# EAGLE design double_in1_atmega (EAGLE 9.1.0)
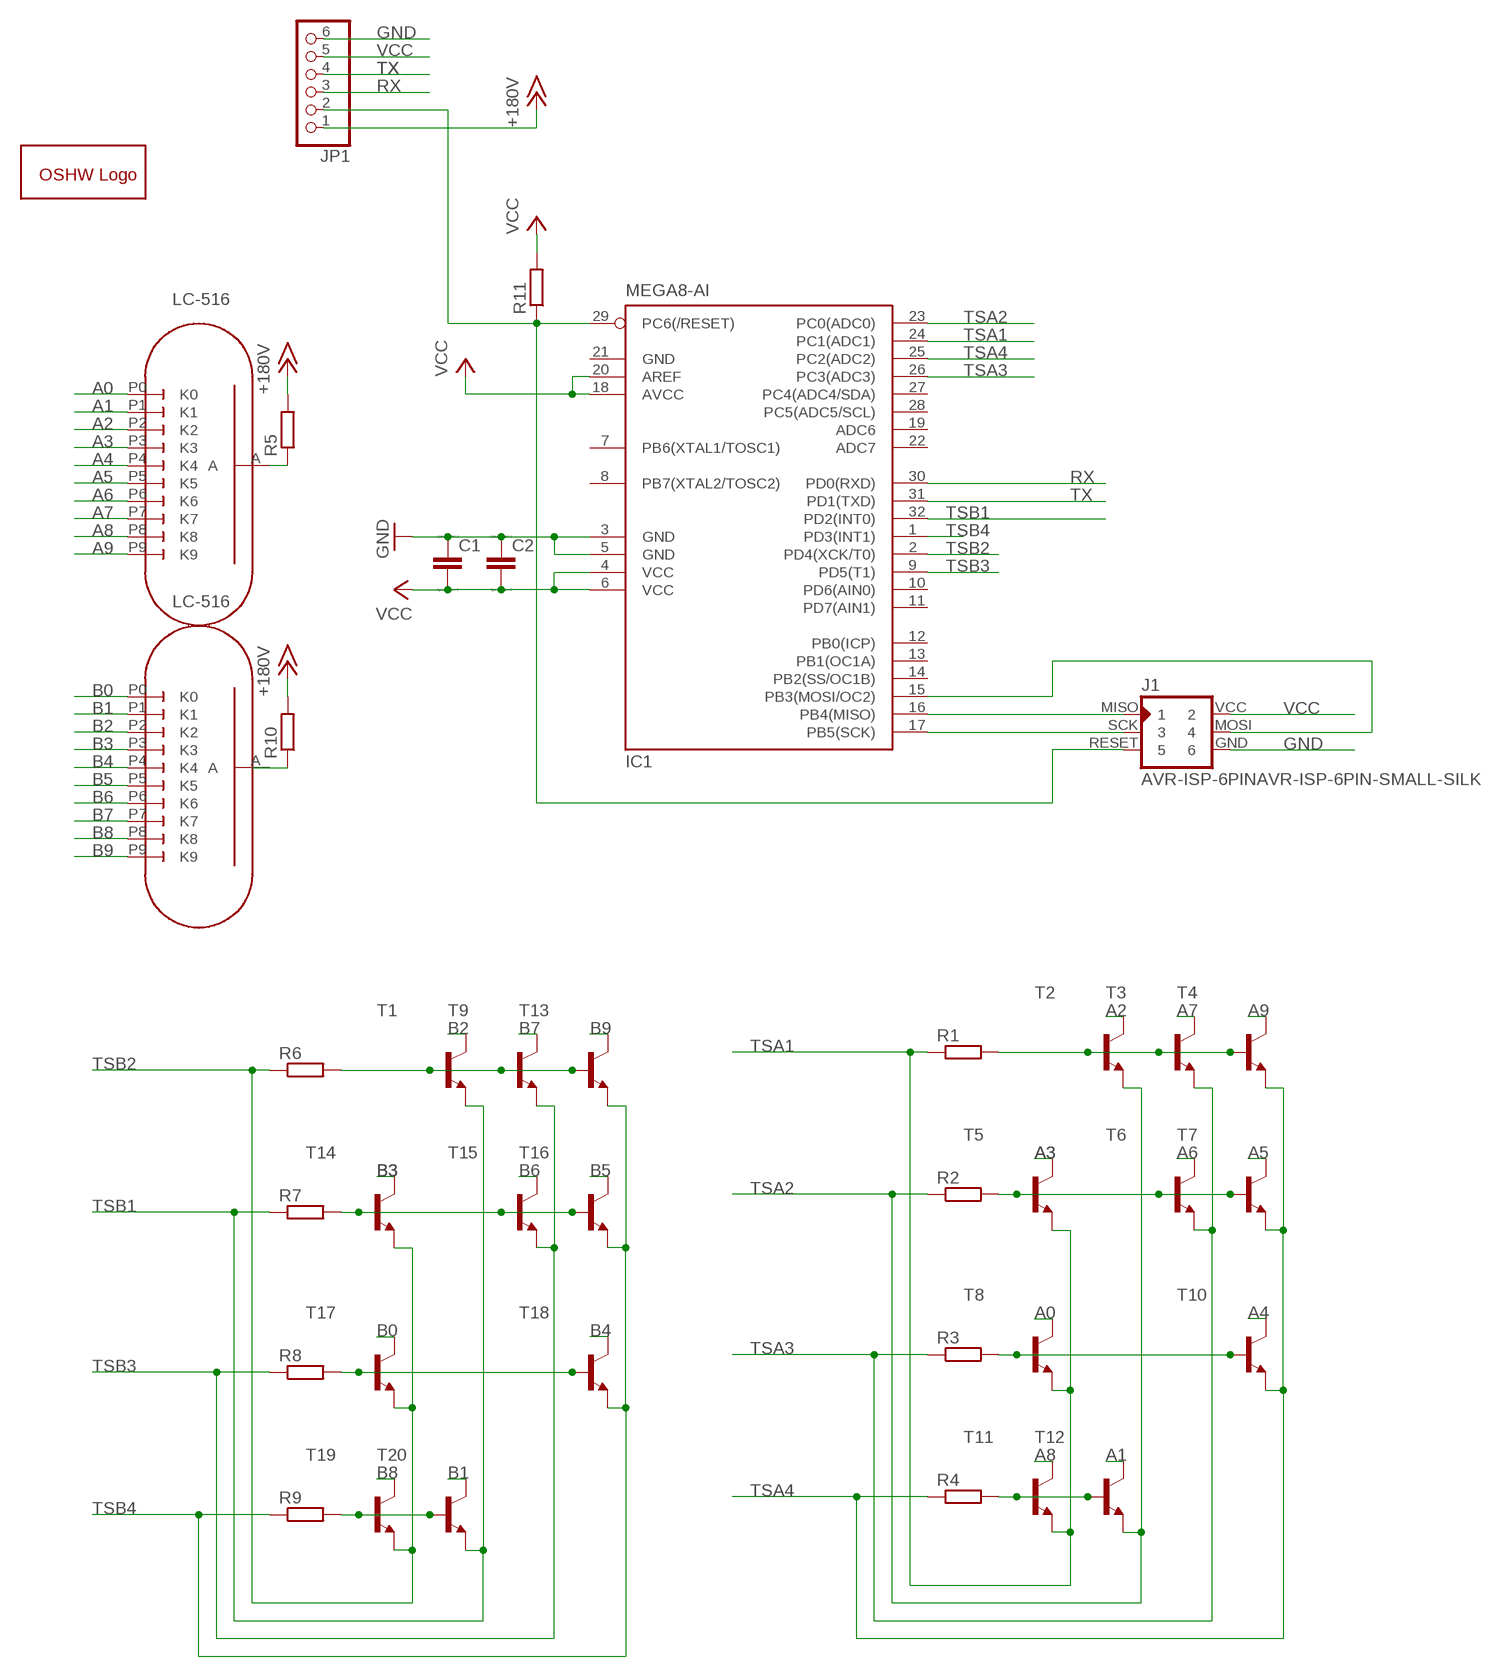
[diagram p0: schematic, sheet 1]

## Parts
C1  C  [C0805]
C2  C  [C0805]
GOLD_ORB_SM1  OSHWLOGOLOGO5MM  [OSHW_5MM]
IC1  MEGA8-AI  [TQFP32-08]
J1  AVR-ISP-6PINAVR-ISP-6PIN-SMALL-SILK  [AVR-ISP-6PIN-SMAILL-SILK]
JP1  PINHD-1X6  [1X06]
R1  R-EU_R0603  [R0603]
R2  R-EU_R0603  [R0603]
R3  R-EU_R0603  [R0603]
R4  R-EU_R0603  [R0603]
R5  R-EU_M1206  [M1206]
R6  R-EU_R0603  [R0603]
R7  R-EU_R0603  [R0603]
R8  R-EU_R0603  [R0603]
R9  R-EU_R0603  [R0603]
R10  R-EU_M1206  [M1206]
R11  R-EU_R0603  [R0603]
T1  MMBTA42LT1-NPN-SOT23-BEC  [SOT23-BEC]
T2  MMBTA42LT1-NPN-SOT23-BEC  [SOT23-BEC]
T3  MMBTA42LT1-NPN-SOT23-BEC  [SOT23-BEC]
T4  MMBTA42LT1-NPN-SOT23-BEC  [SOT23-BEC]
T5  MMBTA42LT1-NPN-SOT23-BEC  [SOT23-BEC]
T6  MMBTA42LT1-NPN-SOT23-BEC  [SOT23-BEC]
T7  MMBTA42LT1-NPN-SOT23-BEC  [SOT23-BEC]
T8  MMBTA42LT1-NPN-SOT23-BEC  [SOT23-BEC]
T9  MMBTA42LT1-NPN-SOT23-BEC  [SOT23-BEC]
T10  MMBTA42LT1-NPN-SOT23-BEC  [SOT23-BEC]
T11  MMBTA42LT1-NPN-SOT23-BEC  [SOT23-BEC]
T12  MMBTA42LT1-NPN-SOT23-BEC  [SOT23-BEC]
T13  MMBTA42LT1-NPN-SOT23-BEC  [SOT23-BEC]
T14  MMBTA42LT1-NPN-SOT23-BEC  [SOT23-BEC]
T15  MMBTA42LT1-NPN-SOT23-BEC  [SOT23-BEC]
T16  MMBTA42LT1-NPN-SOT23-BEC  [SOT23-BEC]
T17  MMBTA42LT1-NPN-SOT23-BEC  [SOT23-BEC]
T18  MMBTA42LT1-NPN-SOT23-BEC  [SOT23-BEC]
T19  MMBTA42LT1-NPN-SOT23-BEC  [SOT23-BEC]
T20  MMBTA42LT1-NPN-SOT23-BEC  [SOT23-BEC]
U$1  LC-516  [LC-516]
U$2  LC-516  [LC-516]

## Nets
+15V: JP1.1 R5.2 R10.2 ; supply symbol labelled +180V
A0: T8.C U$1.P0(K0)
A1: T12.C U$1.P1(K1)
A2: T2.C U$1.P2(K2)
A3: T5.C U$1.P3(K3)
A4: T10.C U$1.P4(K4)
A5: T7.C U$1.P5(K5)
A6: T6.C U$1.P6(K6)
A7: T3.C U$1.P7(K7)
A8: T11.C U$1.P8(K8)
A9: T4.C U$1.P9(K9)
B0: T17.C U$2.P0(K0)
B1: T20.C U$2.P1(K1)
B2: T1.C U$2.P2(K2)
B3: T14.C U$2.P3(K3)
B4: T18.C U$2.P4(K4)
B5: T16.C U$2.P5(K5)
B6: T15.C U$2.P6(K6)
B7: T9.C U$2.P7(K7)
B8: T19.C U$2.P8(K8)
B9: T13.C U$2.P9(K9)
GND: C1.1 C2.1 IC1.3(GND) IC1.5(GND) J1.GND JP1.6
N$1: R10.1 U$2.A
N$2: IC1.29(PC6(/RESET)) J1.RESET JP1.2 R11.1
N$4: R5.1 U$1.A
N$5: IC1.16(PB4(MISO)) J1.MISO
N$9: IC1.17(PB5(SCK)) J1.SCK
N$10: IC1.15(PB3(MOSI/OC2)) J1.MOSI
N$11: R6.2 T1.B T9.B T13.B
N$12: R9.2 T19.B T20.B
N$13: R7.2 T14.B T15.B T16.B
N$14: R4.2 T11.B T12.B
N$15: R8.2 T17.B T18.B
N$16: R3.2 T8.B T10.B
N$17: R2.2 T5.B T6.B T7.B
N$18: R1.2 T2.B T3.B T4.B
RX: IC1.30(PD0(RXD)) JP1.3
TSA1: IC1.24(PC1(ADC1)) R1.1 T5.E T8.E T11.E
TSA2: IC1.23(PC0(ADC0)) R2.1 T2.E T12.E
TSA3: IC1.26(PC3(ADC3)) R3.1 T3.E T6.E
TSA4: IC1.25(PC2(ADC2)) R4.1 T4.E T7.E T10.E
TSB1: IC1.32(PD2(INT0)) R7.1 T1.E T20.E
TSB2: IC1.2(PD4(XCK/T0)) R6.1 T14.E T17.E T19.E
TSB3: IC1.9(PD5(T1)) R8.1 T9.E T15.E
TSB4: IC1.1(PD3(INT1)) R9.1 T13.E T16.E T18.E
TX: IC1.31(PD1(TXD)) JP1.4
VCC: C1.2 C2.2 IC1.4(VCC) IC1.6(VCC) IC1.18(AVCC) IC1.20(AREF) J1.VCC JP1.5 R11.2
Unconnected: IC1.7(PB6(XTAL1/TOSC1)) IC1.8(PB7(XTAL2/TOSC2)) IC1.10(PD6(AIN0)) IC1.11(PD7(AIN1)) IC1.12(PB0(ICP)) IC1.13(PB1(OC1A)) IC1.14(PB2(SS/OC1B)) IC1.19(ADC6) IC1.22(ADC7) IC1.27(PC4(ADC4/SDA)) IC1.28(PC5(ADC5/SCL))

## Power pins joined to a net without a drawn wire
GND: IC1.21(GND)

## Library data of the parts
C1 C2 = eagle-ltspice:C: CAPACITOR, European symbol; SPICEMODEL: NONE; SPICEPREFIX: C
GOLD_ORB_SM1 = oshw:OSHWLOGO: The OSHW logo for PCB layout
IC1 = atmel:MEGA8: MICROCONTROLLER 8 Kbytes FLASH, 1 kbytes SRAM, 512 bytes EEPROM, USART, 6-channel 10 bit ADC, 2-channel 8 bit ADC Pin compatible with Atmega48, ATMega88, ATMega168 Source: avr.lbr; MPN: ATMEGA8-16AU; OC_FARNELL: 9171371; OC_NEWARK: 73M8863
J1 = avr-isp:AVR-ISP-6PIN: AVR ISP 6pin 3x2 pin header
JP1 = pinhead:PINHD-1X6: PIN HEADER
R1-R4 R6-R9 R11 = resistor:R-EU_: RESISTOR, European symbol
R5 R10 = rcl:R-EU_: RESISTOR, European symbol; SPICEPREFIX: R
T1-T20 = transistor:*-NPN-: NPN Transistror BF959 corrected 2008.03.06
U$1 U$2 = LC-516_play:LC-516: Nixie Tube LC-516 with play to align nixie

## Net classes
0 default: clearance 0.205 mm

## Board
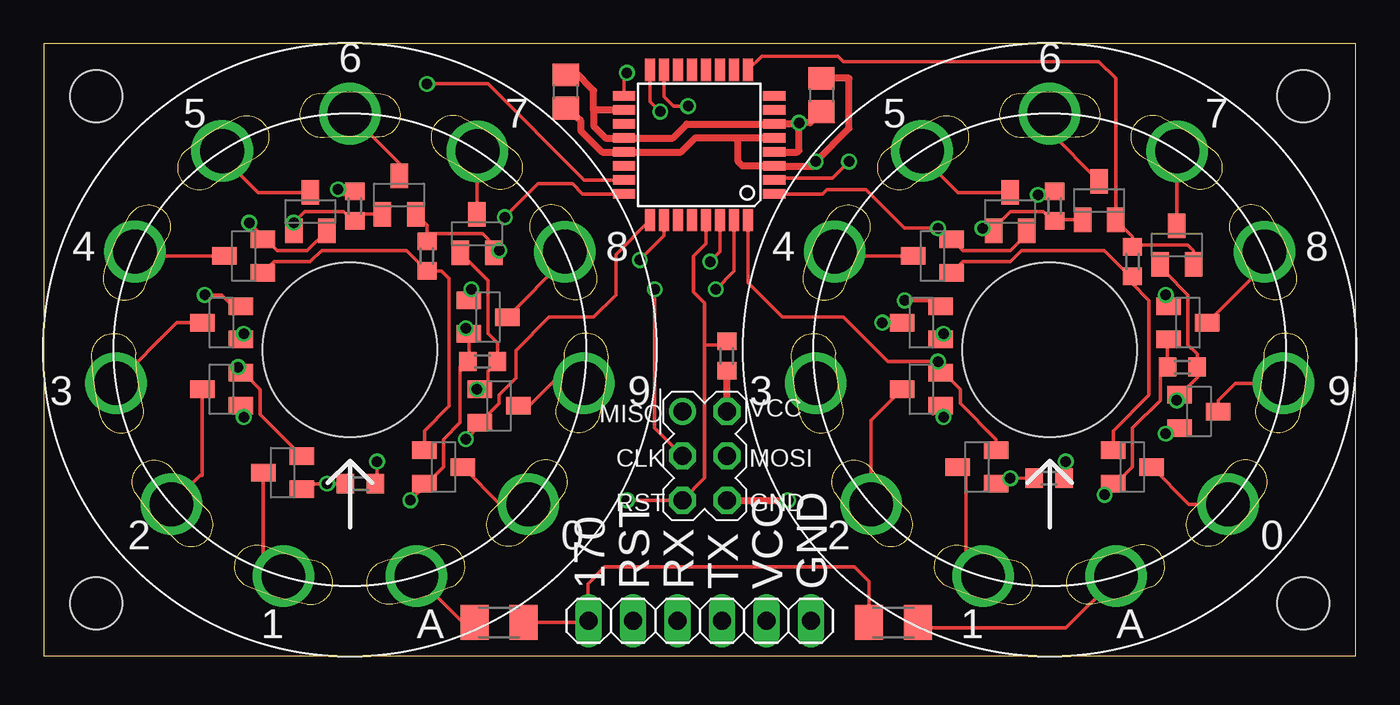
[diagram p1: board, top side]
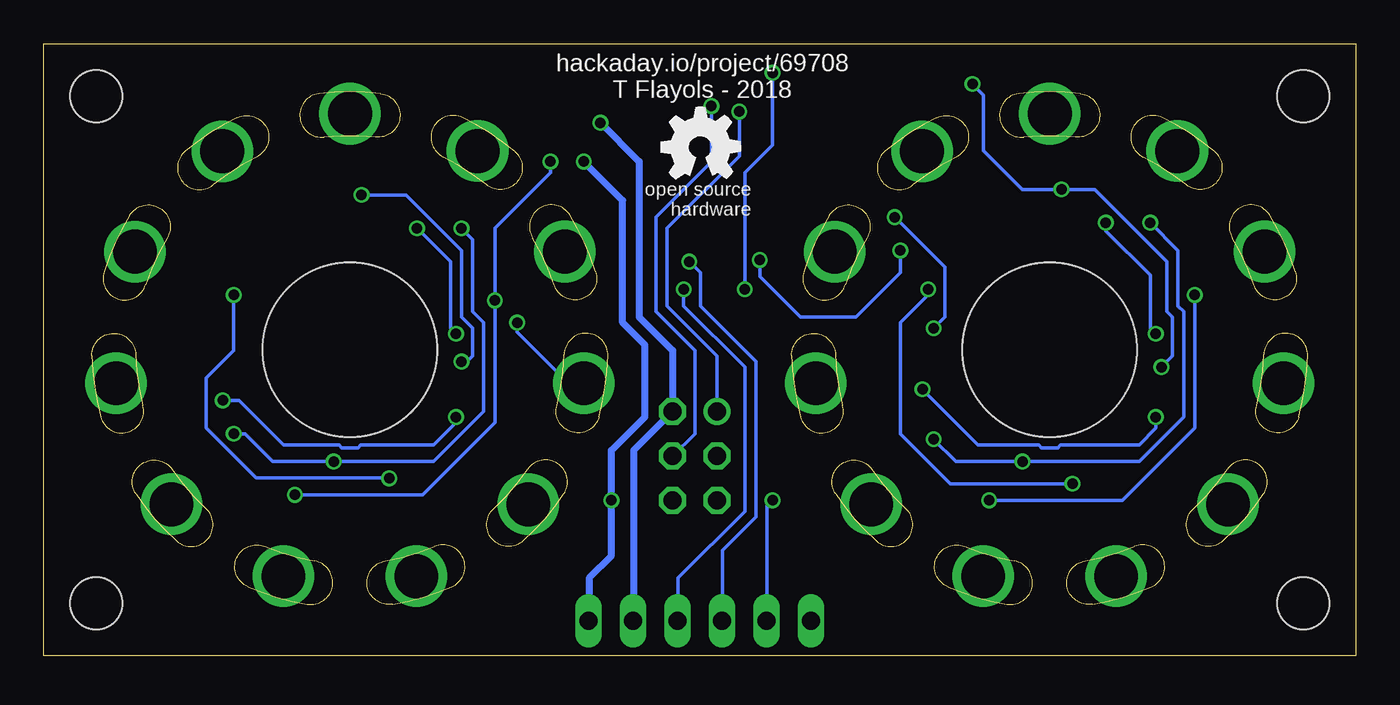
[diagram p2: board, bottom side, seen from below]

Size 75 x 35 mm. Coordinates in mm from the lower left corner, seen from the top.
Outline: 0,0 75,0 75,35 0,35 0,0
Copper layers (1*16): Top 0.035mm / dielectric 1.5mm / Bottom 0.035mm
Design rules "SeeedStudio_2layer_DRU_no_angle_20140221": minimum track width 6mil, minimum drill 12mil, track to track 6mil, track to pad 6mil, pad to pad 6mil, via to via 6mil, smd to smd 0mil, copper to edge 10mil, drill to drill 10mil, minimum pad ring 10mil, minimum via ring 6mil, stop-mask expansion 2mil, vias tented up to drill 100mil, thermal gap 10mil
Holes 3 mm at 3,32 3,3 72,3 72,32

### Footprints (pad centres in the part's own frame; a part is rotated, then mirrored left to right if it is on the bottom)
C0805 = smd 1.3 x 1.5: 1 -0.95,0; 2 0.95,0
TQFP32-08 = smd 1.27 x 0.559: 1 -4.293,2.8; 2 -4.293,2; 3 -4.293,1.2; 4 -4.293,0.4; 5 -4.293,-0.4; 6 -4.293,-1.2; 7 -4.293,-2; 8 -4.293,-2.8; 17 4.293,-2.8; 18 4.293,-2; 19 4.293,-1.2; 20 4.293,-0.4; 21 4.293,0.4; 22 4.293,1.2; 23 4.293,2; 24 4.293,2.8 | smd 0.559 x 1.27: 9 -2.8,-4.293; 10 -2,-4.293; 11 -1.2,-4.293; 12 -0.4,-4.293; 13 0.4,-4.293; 14 1.2,-4.293; 15 2,-4.293; 16 2.8,-4.293; 25 2.8,4.293; 26 2,4.293; 27 1.2,4.293; 28 0.4,4.293; 29 -0.4,4.293; 30 -1.2,4.293; 31 -2,4.293; 32 -2.8,4.293
AVR-ISP-6PIN-SMAILL-SILK = drill 1.016 octagon: GND 1.27,-2.54; MOSI 1.27,0; RESET -1.27,-2.54; SCK -1.27,0; VCC 1.27,2.54 | drill 1.016: MISO -1.27,2.54
1X06 = drill 1.016 long: 1 -6.35,0; 2 -3.81,0; 3 -1.27,0; 4 1.27,0; 5 3.81,0; 6 6.35,0
R0603 = smd 1 x 1.1: 1 -0.85,0; 2 0.85,0
M1206 = smd 1.6 x 2: 1 -1.4,0; 2 1.4,0
SOT23-BEC = smd 1 x 1.4: B -0.95,-1.1; C 0,1.1; E 0.95,-1.1
LC-516 = drill 2.5: A 3.8,-12.95; P0 10.205,-8.84; P1 -3.8,-12.95; P2 -10.205,-8.84; P3 -13.365,-1.915; P4 -12.28,5.615; P5 -7.3,11.36; P6 -0.01,13.5; P7 7.295,11.355; P8 12.28,5.61; P9 13.36,-1.915 | hole 10: 0,0

### Placement (x,y rotation side)
C1  44.45,32.07 270 top
C2  29.84,32.26 90 top
GOLD_ORB_SM1  37.47,29.08 0 bottom
IC1  37.47,29.21 180 top
J1  37.78,11.43 0 top
JP1  37.5,2 0 top
R1  25.08,16.83 0 top
R2  17.78,25.72 270 top
R3  21.91,22.86 270 top
R4  18.1,9.84 180 top
R5  26.04,1.91 0 top
R6  65.09,16.51 0 top
R7  57.78,25.72 270 top
R8  62.23,22.54 270 top
R9  57.47,10.16 180 top
R10  48.58,1.91 180 top
R11  39.05,17.14 270 top
T1  50.16,15.24 90 top
T2  10.16,15.24 90 top
T3  24.77,24.13 0 top
T4  26.04,14.29 270 top
T5  10.16,19.05 90 top
T6  20.32,26.35 0 top
T7  15.24,25.4 0 top
T8  22.86,10.79 270 top
T9  64.77,23.5 0 top
T10  11.43,22.86 90 top
T11  25.4,19.37 270 top
T12  13.65,10.48 90 top
T13  66.04,13.97 270 top
T14  50.16,19.05 90 top
T15  60.33,26.04 0 top
T16  55.24,25.4 0 top
T17  62.23,10.79 270 top
T18  50.8,22.86 90 top
T19  65.41,19.05 270 top
T20  53.34,10.79 90 top
U$1  17.5,17.5 0 top
U$2  57.5,17.5 0 top

### Tracks (layer width: path | path; a pad name or v marks a point on that pad's centre or on a via)
+15V
  Top 0.203: R5.2 31.05,1.91 31.11,1.97 | 31.11,1.97 JP1.1 | 31.11,1.97 31.11,4.13 32.07,5.08 46.35,5.08 47.18,4.26 R10.2
A0
  Top 0.203: T8.C 26.09,8.66 U$1.P0
A1
  Top 0.203: T12.C 12.55,5.7 U$1.P1
A2
  Top 0.203: T2.C 9.06,10.32 8.95,10.32 U$1.P2
A3
  Top 0.203: 8.47,19.05 T5.C 7.6,19.05 U$1.P3
A4
  Top 0.203: T10.C 5.47,22.86 U$1.P4
A5
  Top 0.203: T7.C 12.25,26.5 10.2,28.55 U$1.P5
A6
  Top 0.203: 20.03,27.45 T6.C 20.32,28.17 U$1.P6
A7
  Top 0.203: T3.C 24.77,26.35 24.77,27.48 24.77,28.82 U$1.P7
A8
  Top 0.203: T11.C 29.78,22.65 U$1.P8
A9
  Top 0.203: T4.C 27.74,14.29 29.27,15.81 29.5,15.59 U$1.P9
B0
  Top 0.203: T17.C 65.47,8.66 U$2.P0
B1
  Top 0.203: T20.C 52.7,10.79 52.7,5.71 53.98,4.45 53.7,4.49 U$2.P1
B2
  Top 0.203: T1.C 47.3,13.47 U$2.P2
B3  (via drill 0.6)
  Top 0.203: T14.C v47.94,19.05
  Bottom 0.203: v47.94,19.05 47.94,18.52 45.01,15.59 U$2.P3
B4
  Top 0.203: 49.6,22.96 T18.C 46.32,22.86 46.07,23.11 U$2.P4
B5
  Top 0.203: T16.C 52.25,26.5 50.2,28.55 U$2.P5
B6
  Top 0.203: T15.C 60.33,27.16 57.49,29.99 U$2.P6
B7
  Top 0.203: T9.C 64.77,27.48 64.8,27.5 U$2.P7
B8
  Top 0.203: T19.C 69.78,22.32 U$2.P8
B9
  Top 0.203: U$2.P9 68.12,15.59 67.14,14.61 T13.C
GND  (via drill 0.6)
  Top 0.406: J1.GND v42.55,8.89 | IC1.5 39.69,29.61 | 39.69,29.61 37.23,29.61 36.43,28.81 IC1.21 31.92,28.81 30.69,30.04 30.69,30.59 C2.1 | C1.1 46.04,33.02 46.04,30.16 v44.13,28.26 44.13,28.01 IC1.3 39.94,28.01 39.69,28.26 39.69,29.61
  Bottom 0.406: JP1.6 43.81,2.04 43.81,4.45 42.55,5.71 v42.55,8.89 42.55,11.75 40.64,13.65 40.64,17.78 41.91,19.05 41.91,26.04 v44.13,28.26
N$1
  Top 0.203: U$2.A 61.3,4.47 58.42,1.59 50.3,1.59 R10.1
N$2  (via drill 0.6)
  Top 0.203: 37.78,17.78 37.78,20.17 37.15,20.8 37.15,22.86 37.87,23.58 IC1.29 | 37.78,17.78 37.78,10.16 J1.RESET v33.34,8.89 | R11.1 38.72,17.78 37.78,17.78
  Bottom 0.203: v33.34,8.89 33.66,8.57 33.66,2.04 JP1.2
N$4
  Top 0.203: U$1.A 23.95,1.91 R5.1
N$5  (via drill 0.6)
  Top 0.203: v35.24,31.11 34.66,31.69 IC1.16
  Bottom 0.203: J1.MISO 36.51,17.14 39.37,20 39.37,24.45 35.24,28.57 v35.24,31.11
N$9  (via drill 0.6)
  Top 0.203: J1.SCK 34.92,13.02 v34.92,20.95 | IC1.17 33.17,33.17 v33.34,33.34
  Bottom 0.203: v34.92,20.95 34.92,27.62 33.34,29.21 v33.34,33.34
N$10  (via drill 0.6)
  Top 0.203: IC1.15 35.47,31.97 36,31.43 v36.83,31.43
  Bottom 0.203: J1.MOSI 37.78,12.7 37.78,17.46 40.01,19.68 40.01,25.08 36.83,28.26 v36.83,31.43
N$11  (via drill 0.6)
  Top 0.203: 50.81,13.84 T1.B 51.44,14.29 v51.44,13.65 | T9.B 64.14,22.23 64.14,21.91 65.41,20.64 65.41,17.78 65.94,17.25 R6.2 65.94,15.92 T13.B 64.77,14.75 v64.77,14.61
  Bottom 0.203: v51.44,13.65 51.44,13.34 52.7,12.06 56.87,12.06 57.04,11.89 57.96,11.89 58.13,12.06 61.28,12.06 63.82,14.61 v64.77,14.61
N$12  (via drill 0.6)
  Top 0.203: T20.B 54.74,10.14 v55.24,10.15 | v55.24,10.15 v55.25,10.15 | v55.25,10.15 R9.2 | T19.B 64.31,20.47 v64.14,20.64 | v55.25,10.15 v55.24,10.15 | v55.24,10.15
  Bottom 0.203: v64.14,20.64 64.14,17.46 65.72,15.88 65.72,13.02 62.87,10.16 v55.26,10.16 v55.25,10.15
N$13  (via drill 0.6)
  Top 0.203: v53.66,24.45 54.15,24.45 T16.B 54.3,24.45 55.24,25.4 57.13,25.4 57.47,25.07 R7.2 57.92,24.93 T15.B | v51.44,18.41 51.27,18.25 T14.B
  Bottom 0.203: v53.66,24.45 51.75,22.54 51.75,18.73 v51.44,18.41
N$14  (via drill 0.6)
  Top 0.203: T12.B 15.07,9.84 v16.19,9.84 R4.2 | v24.45,20.95 24.3,20.81 T11.B
  Bottom 0.203: v16.19,9.84 23.18,9.84 26.04,12.7 26.04,19.05 24.45,20.64 v24.45,20.95
N$15
  Top 0.203: T18.B 52.53,22.54 55.24,22.54 55.88,23.18 60.64,23.18 62.13,21.69 R8.2 62.23,21.27 63.18,20.32 63.18,14.92 61.13,12.87 T17.B
N$16
  Top 0.203: T10.B 13.16,22.54 15.24,22.54 15.88,23.18 20.74,23.18 R3.2 22.74,22.01 23.18,21.57 23.18,14.29 21.76,12.87 T8.B
N$17  (via drill 0.6)
  Top 0.203: T6.B 17.96,25.25 R2.2 17.48,25.07 17.14,25.4 14.92,25.4 v14.29,24.77 T7.B | T5.B 11.43,18.1 v11.43,18.41
  Bottom 0.203: v11.43,18.41 11.75,18.73 11.75,21.76 T7.B v14.29,24.77
N$18  (via drill 0.6)
  Top 0.203: T3.B 25.4,21.45 25.4,18.41 25.93,17.88 R1.2 25.4,16.3 25.4,15.7 T4.B v24.77,15.24 | T2.B 11.43,14.12 v11.43,13.65 11.26,13.82 T2.B
  Bottom 0.203: v24.77,15.24 21.59,12.06 18.13,12.06 17.96,11.89 17.04,11.89 16.87,12.06 12.38,12.06 11.43,13.02 v11.43,13.65
RX  (via drill 0.6)
  Top 0.203: IC1.30 38.66,23.11 v38.1,22.54
  Bottom 0.203: JP1.3 36.2,2.04 36.2,6.03 34.29,7.94 34.29,16.83 37.47,20 37.47,21.91 v38.1,22.54
TSA1  (via drill 0.6)
  Top 0.203: IC1.24 30.8,26.41 30.22,26.99 28.26,26.99 v26.35,25.08 | T11.E 24.43,18.29 | T5.E 10.79,20 10.16,20.64 v9.21,20.64 | v20.95,8.89 21.76,9.7 T8.E 21.91,9.85 22.86,10.79 22.86,12.38 23.81,13.34 23.81,16.51 24.43,17.13 R1.1 24.3,16.89 T11.E | v24.13,18.73 24.13,18.42 T11.E
  Bottom 0.203: v9.21,20.64 9.21,13.02 13.34,8.89 v20.95,8.89 | 23.98,18.73 v24.13,18.73 23.5,19.37 23.5,22.23 v26.35,25.08
TSA2  (via drill 0.6)
  Top 0.203: 14.93,11.43 T12.E 12.38,13.8 12.38,15.24 11.43,16.19 | 11.43,16.19 T2.E | 11.43,16.19 v11.11,16.51 | v16.83,26.67 17.13,26.37 R2.1 | v21.91,32.7 25.4,32.7 30.89,27.21 IC1.23
  Bottom 0.203: v11.11,16.51 10.48,17.14 10.48,19.37 10.79,19.68 10.79,22.54 14.92,26.67 v16.83,26.67 19.05,26.67 21.27,28.89 21.27,32.07 v21.91,32.7
TSA3  (via drill 0.6)
  Top 0.203: 25.71,23.5 25.08,24.13 21.91,24.13 | 25.71,23.5 T3.E | 25.71,23.5 v26.04,23.18 | IC1.26 35.47,24.04 v34.07,22.64 | T6.E 21.91,24.61 21.91,24.13 | 21.91,24.13 R3.1
  Bottom 0.203: v26.04,23.18 26.04,21.91 28.57,19.37 31.75,19.37 34.07,21.69 v34.07,22.64
TSA4  (via drill 0.6)
  Top 0.203: T7.E 15.07,23.18 13.34,23.18 12.7,23.81 T10.E 12.53,23.98 v11.75,24.77 | 24.93,13.48 T4.E | IC1.25 32.7,22.95 32.7,20.64 31.43,19.37 28.89,19.37 26.99,17.46 26.99,15.88 26.04,14.92 26.04,14.44 T4.E | v24.13,12.38 24.93,13.19 T4.E | R4.1 19.05,9.95 v19.05,11.11
  Bottom 0.203: v24.13,12.38 22.86,11.11 v19.05,11.11 12.38,11.11 9.84,13.65 9.84,19.68 10.16,20 10.16,23.18 v11.75,24.77
TSB1  (via drill 0.6)
  Top 0.203: T20.E 54.44,12.38 52.39,14.44 52.39,15.24 51.44,16.19 T1.E 51.27,16.83 v51.12,16.83 48.26,16.83 45.72,19.37 42.23,19.37 40.27,21.33 IC1.32 | v56.83,26.35 58.1,26.35 R7.1
  Bottom 0.203: v56.83,26.35 54.29,26.35 51.12,23.18 51.12,19.37 50.48,18.73 50.48,17.14 50.8,16.83 v51.12,16.83
TSB2  (via drill 0.6)
  Top 0.203: 64.12,17.91 T19.E 64.24,18.03 R6.1 63.82,16.52 63.82,14.61 62.23,13.02 62.23,10.79 61.28,9.85 T17.E 61.28,9.84 v60.64,9.21 | T14.E 51.12,20 50.8,20.32 v49.21,20.32 | v46.04,28.26 45.09,27.3 42.82,27.3 41.59,27.3 41.69,27.21 IC1.2
  Bottom 0.203: v60.64,9.21 53.34,9.21 49.21,13.34 v49.21,20.32 49.21,24.45 46.04,27.62 v46.04,28.26
TSB3
  Top 0.203: T9.E 65.72,23.18 65.41,23.5 62.24,23.5 R8.1 62.23,23.98 T15.E 61.28,33.02 60.33,33.97 45.72,33.97 45.4,34.29 41.05,34.29 IC1.9
TSB4  (via drill 0.6)
  Top 0.203: T16.E 56.2,24.13 55.24,23.18 52.53,23.18 T18.E 51.76,23.81 v51.12,24.45 49.21,24.45 46.99,26.67 44.77,26.67 44.51,26.41 IC1.1 | R9.1 58.44,11.11 v58.42,11.11 | v64.14,12.7 64.31,12.87 T13.E
  Bottom 0.203: v64.14,12.7 63.5,12.7 61.91,11.11 v58.42,11.11 52.7,11.11 49.85,13.97 49.85,19.05 50.48,19.68 50.48,23.81 v51.12,24.45
TX  (via drill 0.6)
  Top 0.203: IC1.31 39.47,22 v38.42,20.95
  Bottom 0.203: JP1.4 38.73,2.04 38.73,4.45 34.92,8.26 34.92,13.02 34.92,16.51 38.42,20 v38.42,20.95
VCC  (via drill 0.6)
  Top 0.406: J1.VCC R11.2 | C1.2 43.81,30.48 v43.18,30.48 | v43.18,30.48 43.11,30.41 IC1.6 36.76,30.41 35.96,29.61 IC1.20 32.11,29.61 31.43,30.29 31.43,31.18 | IC1.4 43.1,28.81 43.18,28.89 v43.18,30.48 | IC1.18 31.46,31.21 31.43,31.18 | C2.2 30.42,33.34 31.43,32.32 31.43,31.18
  Bottom 0.406: v43.18,30.48 40.96,28.26 40.96,19.37 39.05,17.46 J1.VCC 41.27,11.75 41.27,2.04 JP1.5 41.27,2

### Text on the board
tNames: VCC | MISO | CLK | MOSI | RST | GND | 170 | RST | RX | TX | VCC | GND
bNames: hackaday.io/project/69708 / T Flayols - 2018